# Altium schematic sheet Sheet1.SchDoc: <page title>
size Letter; Author: JRL; Organization: Engenuics Technologies Inc; Address1: 1835 19 Avenue NW; Address2: Calgary, AB  T2M 1B6; Address3: CANADA; Address4: 1-403-998-1422; DocumentNumber: <PPPP-DTTT->; Revision: <###>; SheetNumber: <x>; SheetTotal: <y>
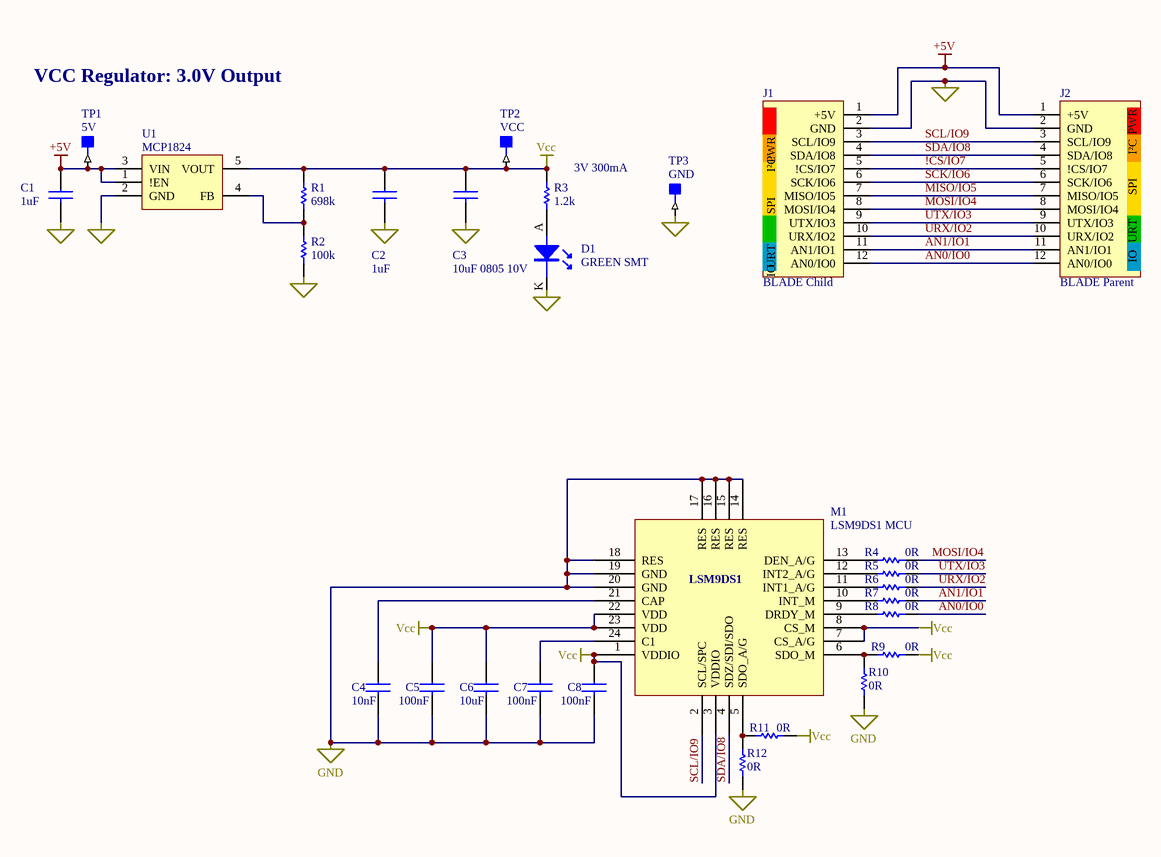
[diagram p0: Sheet1.SchDoc]

## Parts
C1  1uF  [0603]
C2  1uF  [0603]
C3  10uF 0805 10V  [0805]
C4  10nF  [0603]
C5  100nF  [0603]
C6  10uF  [0603]
C7  100nF  [0603]
C8  100nF  [0603]
D1  GREEN SMT  [0603 AK]
J1  BLADE Child  [HDR1X12 ENGENUICS CHILD]
J2  BLADE Parent  [HDR1X12 ENGENUICS PARENT]
M1  LSM9DS1 MCU  [LSM9DS3]
R1  698k  [0603]
R2  100k  [0603]
R3  1.2k  [0603]
R4  0R  [0603]
R5  0R  [0603]
R6  0R  [0603]
R7  0R  [0603]
R8  0R  [0603]
R9  0R  [0603]
R10  0R  [0603]
R11  0R  [0603]
R12  0R  [0603]
TP1  5V  [TEST POINT SMT]
TP2  VCC  [TEST POINT SMT]
TP3  GND  [TEST POINT SMT]
U1  MCP1824  [SOT23-5]

## Nets
+5V: C1.1 J1.1(+5V) J2.1(+5V) TP1.1 U1.1(!EN) U1.3(VIN)
GND: C1.2 C2.2 C3.2 C4.2 C5.2 C6.2 C7.2 C8.2 D1.K(K1) J1.2(GND) J2.2(GND) M1.14(RES) M1.15(RES) M1.16(RES) M1.17(RES) M1.18(RES) M1.19(GND) M1.20(GND) R2.2 R10.1 R12.1 TP3.1 U1.2(GND)
Vcc: C2.1 C3.1 C5.1 C6.1 C8.1 M1.1(VDDIO) M1.3(VDDIO) M1.7(CS_A/G) M1.8(CS_M) M1.22(VDD) M1.23(VDD) R1.2 R3.2 R9.2 R11.1 TP2.1 U1.5(VOUT)
!CS/IO7: J1.5(!CS/IO7) J2.5(!CS/IO7)
AN0/IO0: J1.12(AN0/IO0) J2.12(AN0/IO0) R8.2
AN1/IO1: J1.11(AN1/IO1) J2.11(AN1/IO1) R7.2
MISO/IO5: J1.7(MISO/IO5) J2.7(MISO/IO5)
MOSI/IO4: J1.8(MOSI/IO4) J2.8(MOSI/IO4) R4.2
SCK/IO6: J1.6(SCK/IO6) J2.6(SCK/IO6)
SCL/IO9: J1.3(SCL/IO9) J2.3(SCL/IO9) M1.2(SCL/SPC)
SDA/IO8: J1.4(SDA/IO8) J2.4(SDA/IO8) M1.4(SDZ/SDI/SDO)
URX/IO2: J1.10(URX/IO2) J2.10(URX/IO2) R6.2
UTX/IO3: J1.9(UTX/IO3) J2.9(UTX/IO3) R5.2
NetC4_1: C4.1 M1.21(CAP)
NetC7_1: C7.1 M1.24(C1)
NetD1_A: D1.A(A1) R3.1
NetM1_5: M1.5(SDO_A/G) R11.2 R12.2
NetM1_6: M1.6(SDO_M) R9.1 R10.2
NetM1_9: M1.9(DRDY_M) R8.1
NetM1_10: M1.10(INT_M) R7.1
NetM1_11: M1.11(INT1_A/G) R6.1
NetM1_12: M1.12(INT2_A/G) R5.1
NetM1_13: M1.13(DEN_A/G) R4.1
NetR1_1: R1.1 R2.1 U1.4(FB)

## Notes on the sheet
- VCC Regulator: 3.0V Output
- (near R3) 3V 300mA
- 1835 19 AVE NW
- Calgary, AB  T2M 1B6
- Title:
- Number:
- Date:
- Version
- Sheet:
- of
- Author:
- Revision
- History
- Description / Change Summary
- Date Released
- Approved By
- 1-403-998-1422
- File:
- (in symbol CONN ENGENUICS BLADE CHILD) PWR; I²C; SPI; URT; IO
- (in symbol CONN ENGENUICS BLADE PARENT) PWR; I²C; SPI; URT; IO

## Library data of the parts
C1 C2 = CAPACITOR NON-POLARIZED: 3. Manufacturer Part Number: EMK107BJ105KA-T; 2. Manufacturer: Taiyo Yuden; 5. Internal Part Number: 100009; 1. Description: CAP CER 1uF 10% X5R 16V 0603 SMT; 7. Modified By: JRL; 4. Digi-Key Part Number: 587-1251-2-ND; 6. Last Modified: 2011-08-01
C3 = CAPACITOR NON-POLARIZED: 3. Manufacturer Part Number: LMK212BJ106KG-T; 2. Manufacturer: Taiyo; 5. Internal Part Number: 100006; 1. Description: CAP CER 10UF 10V X5R 0805; 7. Modified By: JRL; 4. Digi-Key Part Number: 587-1300-1-ND; 6. Last Modified: 2010-10-11
C4-C8 = CAPACITOR NON-POLARIZED: 1. Description: CAP [TYPE] [VALUE] [TOLERANCE] [VOLTAGE] [CLASS] [PACKAGE]; 5. Internal Part Number: *; 4. Digi-Key Part Number: *; 3. Manufacturer Part Number: *; 6. Last Modified: *; 7. Modified By: *; 2. Manufacturer: *
D1 = LED T1-3/4: LED; 2. Manufacturer: Lite-on; 3. Manufacturer Part Number: LTST-C190GKT; 5. Internal Part Number: 100065; 1. Description: LED GREEN CLEAR 0603 SMD; 7. Modified By: JRL; 4. Digi-Key Part Number: 160-1183-1-ND; 6. Last Modified: October 18, 2009
J1 = CONN ENGENUICS BLADE CHILD: 2. Manufacturer: FCI; 3. Manufacturer Part Number: 68016-412HLF; 5. Internal Part Number: 100021; 1. Description: CONN HEADER 12POS .100 R/A TIN; 7. Modified By: JRL; 4. Digi-Key Part Number: 609-3330-ND; 6. Last Modified: 2011-08-01
J2 = CONN ENGENUICS BLADE PARENT: 2. Manufacturer: Sullins; 3. Manufacturer Part Number: PPTC121LGBN-RC; 5. Internal Part Number: 100031; 1. Description: CONN TERMINAL 12POS 0.100" RIGHT ANGLE; 7. Modified By: JRL; 4. Digi-Key Part Number: S5448-ND; 6. Last Modified: 2011-04-17
M1 = LSM9DS1: Manufacturer Part Number: LSM9DS1TR; Manufacturer: STMicroelectronics; Digi-Key Part Number: 497-14946-1-ND; Last Modified: 2018-12-08; Modified By: Bud Wandinger
R1 = RESISTOR: 2. Manufacturer: Yageo; 3. Manufacturer Part Number: RC0603FR-07698KL; 5. Internal Part Number: 100087; 1. Description: RES 698K OHM 1/10W 1% 0603 SMD; 7. Modified By: JRL; 4. Digi-Key Part Number: 311-698KHRCT-ND; 6. Last Modified: July 4, 2010
R2 = RESISTOR: 2. Manufacturer: Rohm; 3. Manufacturer Part Number: MCR03EZPJ104; 5. Internal Part Number: 100078; 1. Description: RES 100K OHM 1/10W 5% 0603 SMD; 7. Modified By: JRL; 4. Digi-Key Part Number: RHM100KGCT-ND; 6. Last Modified: 2010-10-11
R3 = RESISTOR: 2. Manufacturer: Rohm; 3. Manufacturer Part Number: MCR03EZPJ122; 5. Internal Part Number: 100076; 1. Description: RES 1.2K OHM 1/10W 5% 0603 SMD; 7. Modified By: JRL; 4. Digi-Key Part Number: RHM1.2KGCT-ND; 6. Last Modified: 2010-10-11
R4-R12 = RESISTOR: 1. Description: RES [VALUE] [POWER] [TOLERANCE] [PACKAGE] [CONSTRUCTION]; 5. Internal Part Number: *; 4. Digi-Key Part Number: *; 2. Manufacturer: *; 3. Manufacturer Part Number: *; 6. Last Modified: *; 7. Modified By: *
TP1-TP3 = TEST POINT SMT: 1. Description: Test pad; 7. Modified By: JRL; 2. Manufacturer: N/A; 3. Manufacturer Part Number: N/A; 4. Digi-Key Part Number: N/A; 5. Internal Part Number: N/A; 6. Last Modified: June 12, 2008
U1 = VREG MCP1824: 2. Manufacturer: Microchip; 3. Manufacturer Part Number: MCP1824T-ADJE/OT; 5. Internal Part Number: 100049; 1. Description: IC LDO REG 300MA ADJ-V SOT23-5; 7. Modified By: JRL; 4. Digi-Key Part Number: MCP1824T-ADJE/OTCT-ND; 6. Last Modified: 2011-04-17